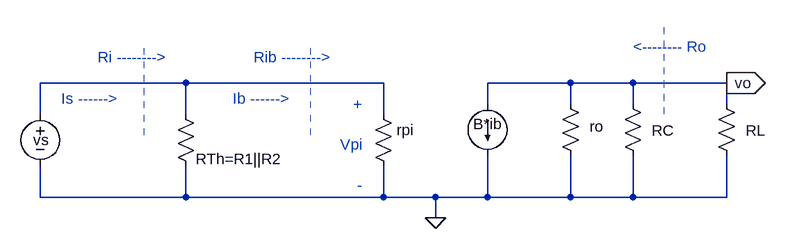
[diagram p0: schematic test6_07_AC_small-signal_RTh.asc]
test6_07_AC_small-signal_RTh.asc, the LTspice schematic file:
Version 4
SHEET 1 1292 680
WIRE 224 96 0 96
WIRE 528 96 224 96
WIRE 816 96 688 96
WIRE 912 96 816 96
WIRE 1056 96 912 96
WIRE 688 128 688 96
WIRE 816 128 816 96
WIRE 912 128 912 96
WIRE 1056 128 1056 96
WIRE 0 144 0 96
WIRE 224 144 224 96
WIRE 528 144 528 96
WIRE 0 272 0 224
WIRE 224 272 224 224
WIRE 224 272 0 272
WIRE 528 272 528 224
WIRE 528 272 224 272
WIRE 608 272 528 272
WIRE 688 272 688 208
WIRE 688 272 608 272
WIRE 816 272 816 208
WIRE 816 272 688 272
WIRE 912 272 912 208
WIRE 912 272 816 272
WIRE 1056 272 1056 208
WIRE 1056 272 912 272
WIRE 608 304 608 272
FLAG 608 304 0
FLAG 1056 96 vo
IOPIN 1056 96 Out
SYMBOL res 208 128 R0
WINDOW 0 31 85 Left 2
SYMATTR InstName RTh=R1||R2
SYMATTR Value ""
SYMBOL res 512 128 R0
SYMATTR InstName rpi
SYMATTR Value ""
SYMBOL current 688 128 R0
WINDOW 0 -22 31 Left 2
SYMATTR InstName B*ib
SYMATTR Value ""
SYMBOL voltage 0 128 R0
WINDOW 0 -11 56 Left 2
SYMATTR InstName vs
SYMATTR Value ""
SYMBOL res 896 112 R0
WINDOW 0 45 57 Left 2
SYMATTR InstName RC
SYMATTR Value ""
SYMBOL res 800 112 R0
WINDOW 0 45 51 Left 2
SYMATTR InstName ro
SYMATTR Value ""
SYMBOL res 1040 112 R0
WINDOW 0 45 57 Left 2
SYMATTR InstName RL
SYMATTR Value ""
TEXT 328 56 Left 2 ;Rib -------->
TEXT 88 56 Left 2 ;Ri -------->
TEXT 912 40 Left 2 ;<-------- Ro
TEXT 296 120 Left 2 ;Ib ------>
TEXT 32 120 Left 2 ;Is ------>
TEXT 496 128 Right 2 ;+\n \nVpi\n \n-
LINE Normal 416 176 416 32 2
LINE Normal 160 176 160 32 2
LINE Normal 960 144 960 0 2

The netlist it stands for:
* test6_07_AC_small-signal_RTh.asc
RTh=R1||R2 N001 0
rpi N001 0
I§B*ib vo 0
vs N001 0
RC vo 0
ro vo 0
RL vo 0
* Rib -------->
* Ri -------->
* <-------- Ro
* Ib ------>
* Is ------>
* +
* Vpi
* -
.backanno
.end